# EAGLE design Proximity_sensor_sch (EAGLE 7.1.0)
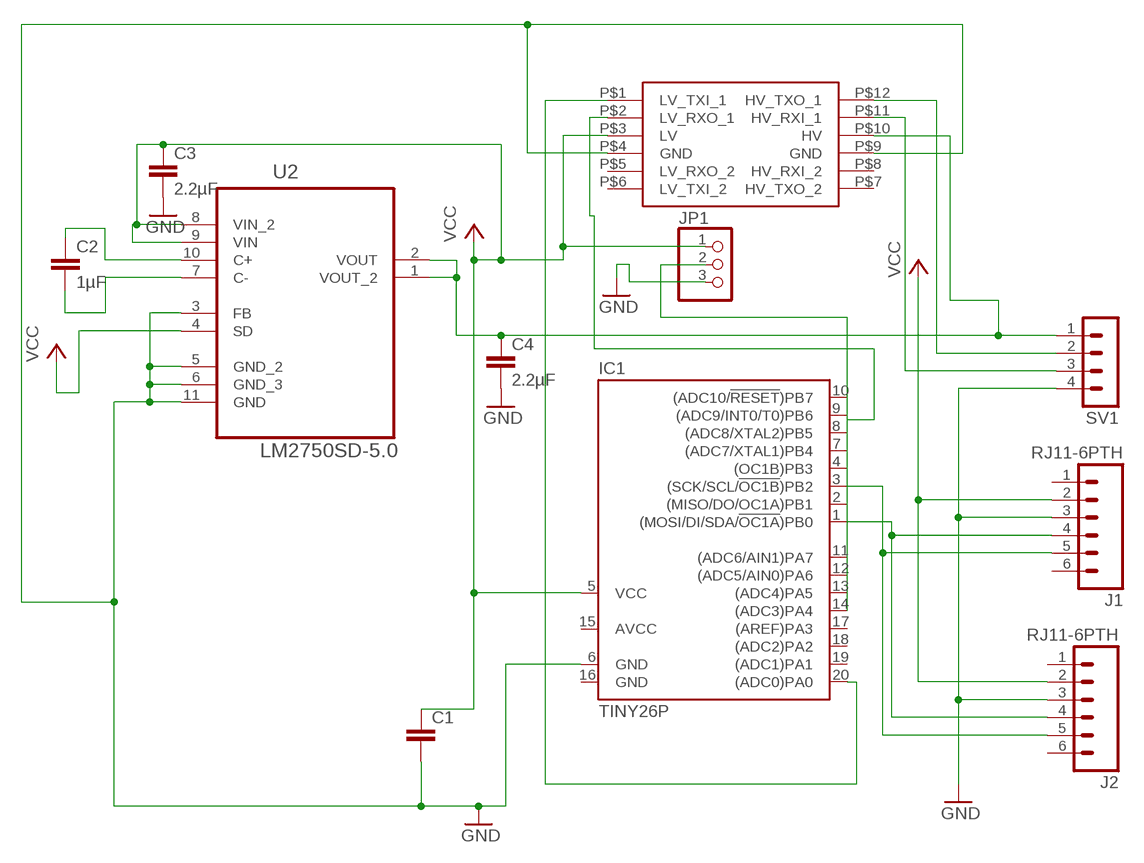
[diagram p0: schematic, sheet 1]

## Parts
C1  C7.5/3  [C7.5B3]
C2  1µF  C7.5/3  [C7.5B3]
C3  2.2µF  C7.5/3  [C7.5B3]
C4  2.2µF  C7.5/3  [C7.5B3]
IC1  TINY26P  [DIL20]
J1  RJ11-6PTH  [RJ11-6]
J2  RJ11-6PTH  [RJ11-6]
JP1  PINHD-1X3  [1X03]
SV1  MA04-1  [MA04-1]
U2  LM2750SD-5.0  [DFN300X300X80-11N]
U$1  LOGIC_LEVEL_CONVERTER  [LOGIC_LEVEL_CONVERTER]

## Nets
GND: C1.2 C3.2 C4.2 IC1.6(GND) J1.3 J2.3 JP1.3 SV1.4 U2.3(FB) U2.5(GND_2) U2.6(GND_3) U2.11(GND) U$1.P$4(GND) U$1.P$9(GND)
N$1: C4.1 SV1.1 U2.1(VOUT_2) U2.2(VOUT) U$1.P$10(HV)
N$2: IC1.1((MOSI/DI/SDA/!OC1A!)PB0) J1.4 J2.4
N$3: IC1.3((SCK/SCL/!OC1B!)PB2) J1.5 J2.5
N$4: IC1.20((ADC0)PA0) U$1.P$1(LV_TXI_1)
N$5: SV1.2 U$1.P$12(HV_TXO_1)
N$6: SV1.3 U$1.P$11(HV_RXI_1)
N$7: IC1.9((ADC9/INT0/T0)PB6) U$1.P$2(LV_RXO_1)
N$8: C2.1 U2.10(C+)
N$9: C2.2 U2.7(C-)
N$25: IC1.14((ADC3)PA4) JP1.2
VCC: C1.1 C3.1 IC1.5(VCC) J1.2 J2.2 JP1.1 U2.4(SD) U2.8(VIN_2) U2.9(VIN) U$1.P$3(LV)
Unconnected: IC1.2((MISO/DO/OC1A)PB1) IC1.4((OC1B)PB3) IC1.7((ADC7/XTAL1)PB4) IC1.8((ADC8/XTAL2)PB5) IC1.10((ADC10/!RESET!)PB7) IC1.11((ADC6/AIN1)PA7) IC1.12((ADC5/AIN0)PA6) IC1.13((ADC4)PA5) IC1.17((AREF)PA3) IC1.18((ADC2)PA2) IC1.19((ADC1)PA1) J1.1 J1.6 J2.1 J2.6 U$1.P$5(LV_RXO_2) U$1.P$6(LV_TXI_2) U$1.P$7(HV_TXO_2) U$1.P$8(HV_RXI_2)

## Power pins joined to a net without a drawn wire
AVCC: IC1.15(AVCC)
GND: IC1.16(GND)

## Library data of the parts
C1-C4 = capacitor-wima:C: CAPACITOR naming: grid - package width
IC1 = atmel:TINY26*: 8-bit AVR Microcontroller with 2K Bytes Flash Source: http://www.atmel.com .. doc1477.pdf; MPN: ATTINY261-20PU; OC_FARNELL: 1455146; OC_NEWARK: 58M3782
J1 J2 = SparkFun-Connectors:RJ11-6: RJ11 Jack Simple 6 pin RJ11 jack. Commonly found on CAT3 devices and Microchip programmers. SKU: PRT-00132
JP1 = adafruit:PINHD-1X3: PIN HEADER
SV1 = con-lstb:MA04-1: PIN HEADER; OC_FARNELL: unknown; OC_NEWARK: unknown
U2 = LM27050SD:LM2750SD-5.0: IC CONV REG SW CAP 5V; MPN: LM2750SD-5.0; OC_FARNELL: 1685760; OC_NEWARK: 69K2411; PACKAGE: 10-WFDFN Exposed Pad; SUPPLIER: National Semiconductor
U$1 = SparkFun-Boards:LOGIC_LEVEL_CONVERTER: Logic Level Converter (3.3v - 5v) https://www.sparkfun.com/products/8745

## Board
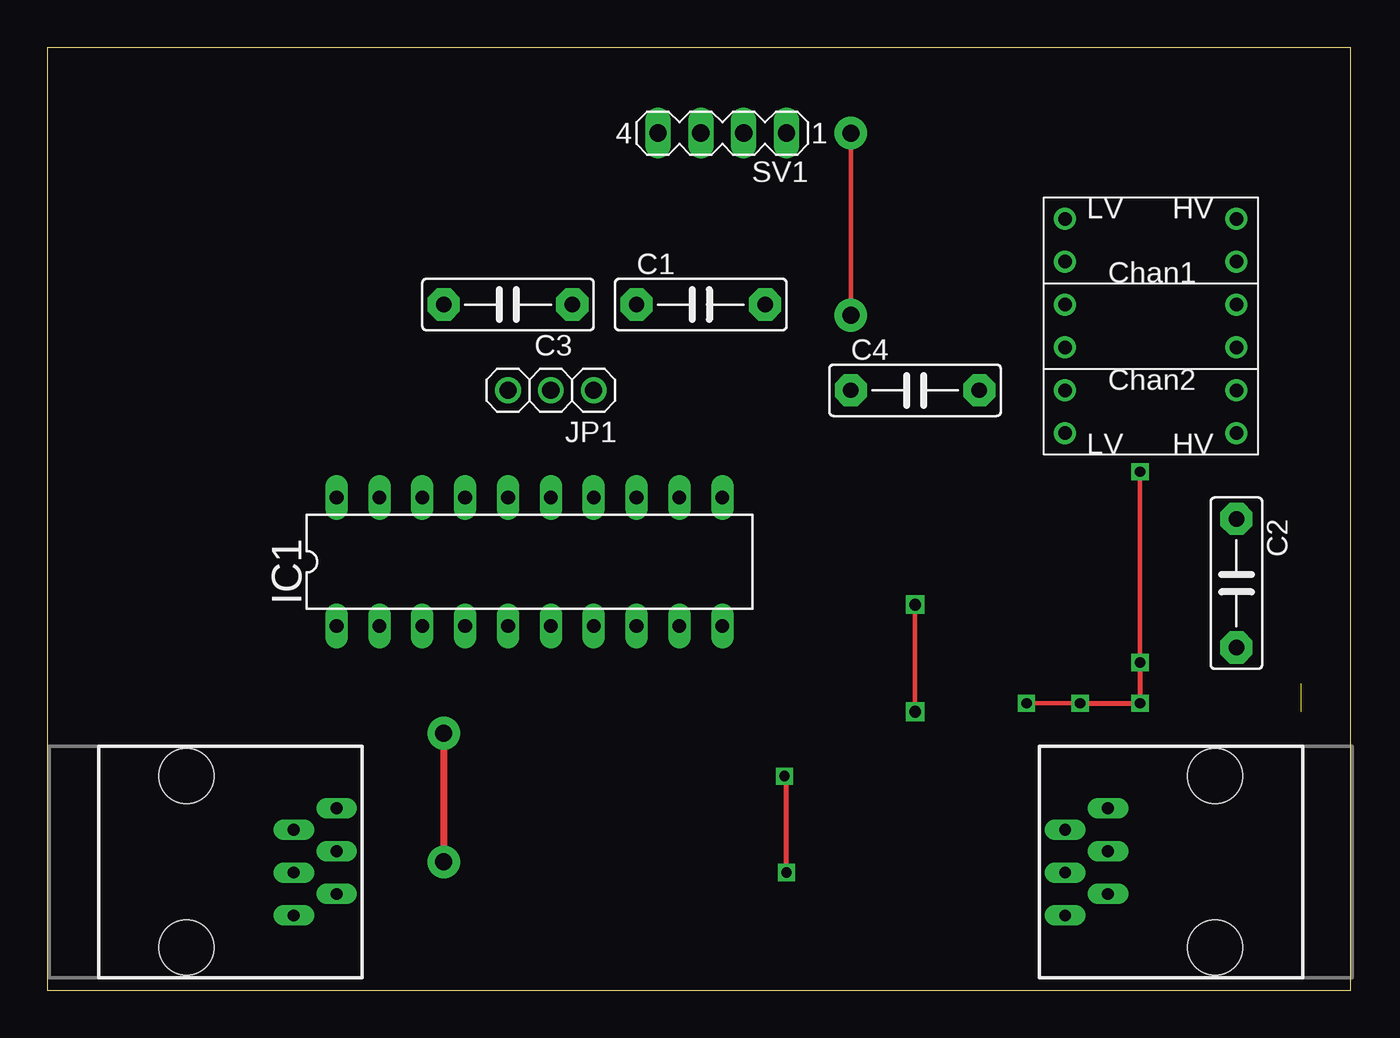
[diagram p1: board, top side]
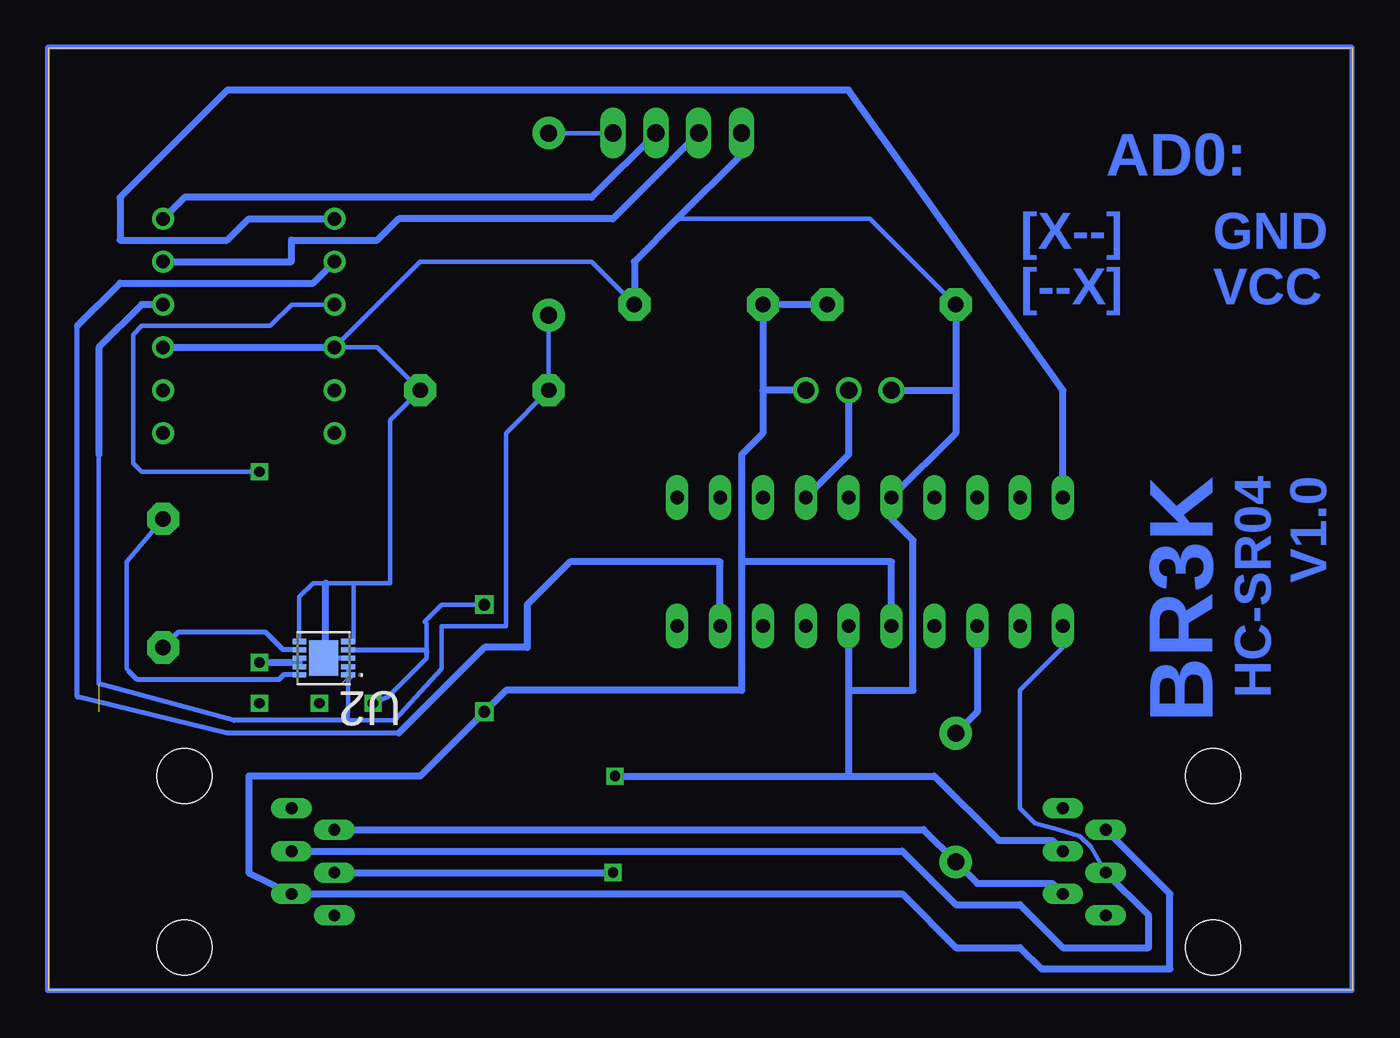
[diagram p2: board, bottom side, seen from below]

Size 77.27 x 55.87 mm. Coordinates in mm from the lower left corner, seen from the top.
Outline: 0,0 77.27,0 77.27,55.87 0,55.87 0,0
Copper layers (1*16): Top 0.035mm / dielectric 1.5mm / Bottom 0.035mm
Design rules "default *": minimum track width 10mil, minimum drill 24mil, track to track 8mil, track to pad 8mil, pad to pad 8mil, via to via 8mil, smd to smd 8mil, copper to edge 20mil, drill to drill 8mil, minimum pad ring 10mil, minimum via ring 8mil, stop-mask expansion 4mil, vias tented up to drill 0mil, thermal gap 10mil

### Footprints (pad centres in the part's own frame; a part is rotated, then mirrored left to right if it is on the bottom)
C7.5B3 = drill 0.914 pad 1.905 octagon: 1 -3.81,0; 2 3.81,0
DIL20 = drill 0.813 long: 1 -11.43,-3.81; 2 -8.89,-3.81; 3 -6.35,-3.81; 4 -3.81,-3.81; 5 -1.27,-3.81; 6 1.27,-3.81; 7 3.81,-3.81; 8 6.35,-3.81; 9 8.89,-3.81; 10 11.43,-3.81; 11 11.43,3.81; 12 8.89,3.81; 13 6.35,3.81; 14 3.81,3.81; 15 1.27,3.81; 16 -1.27,3.81; 17 -3.81,3.81; 18 -6.35,3.81; 19 -8.89,3.81; 20 -11.43,3.81
RJ11-6 = drill 0.7 long: 1 1.905,8.89; 2 3.175,6.35; 3 4.445,8.89; 4 5.715,6.35; 5 6.985,8.89; 6 8.255,6.35 | hole 3.251: 0,0; 10.16,0
1X03 = drill 1.016: 1 -2.54,0; 2 0,0; 3 2.54,0
MA04-1 = drill 1.016 long: 1 -3.81,0; 2 -1.27,0; 3 1.27,0; 4 3.81,0
DFN300X300X80-11N = smd 0.813 x 0.305: 1 -1.448,0.991; 2 -1.448,0.508; 3 -1.448,0; 4 -1.448,-0.508; 5 -1.448,-0.991; 6 1.448,-0.991; 7 1.448,-0.508; 8 1.448,0; 9 1.448,0.508; 10 1.448,0.991 | smd 1.702 x 2.108: 11 0,0
LOGIC_LEVEL_CONVERTER = drill 0.8: P$1 1.27,13.97; P$2 1.27,11.43; P$3 1.27,8.89; P$4 1.27,6.35; P$5 1.27,3.81; P$6 1.27,1.27; P$7 11.43,1.27; P$8 11.43,3.81; P$9 11.43,6.35; P$10 11.43,8.89; P$11 11.43,11.43; P$12 11.43,13.97

### Placement (x,y rotation side)
C1  38.73,40.64 0 top
C2  70.48,24.13 270 top
C3  27.31,40.64 180 top
C4  51.44,35.56 0 top
IC1  28.57,25.4 0 top
J1  69.22,2.54 90 top
J2  8.25,12.7 270 top
JP1  29.85,35.56 180 top
SV1  40,50.8 180 top
U2  60.96,19.68 180 bottom
U$1  59.06,31.75 0 top

### Tracks (layer width: path | path; a pad name or v marks a point on that pad's centre or on a via)
GND  (via drill 0.61)
  Top 0.305: v43.81,6.98 43.81,12.57 v43.69,12.7
  Bottom 0.254: C1.2 45.08,43.18 55.25,43.18 U$1.P$4 57.79,38.1 C4.2 57.02,33.78 57.02,24.13 59.18,24.13 | C3.2 28.57,45.72 40,45.72 | U2.6 62.41,23.32 61.59,24.13 60.83,24.13 59.18,24.13 | U2.5 59.18,20.68 59.18,24.13
  Bottom 0.305: U2.3 U2.11
  Bottom 0.406: J1.3 v43.81,6.98 | 43.81,12.7 v43.69,12.7 29.85,12.7 | 29.85,12.7 24.76,12.7 20.96,8.89 17.78,8.89 J2.3 | 29.85,17.78 29.85,12.7 | SV1.4 36.2,49.53 40,45.72 42.55,43.18 C1.2 | U$1.P$9 U$1.P$4 | C3.2 23.5,35.56 | 23.5,35.56 23.5,33.02 IC1.16 27.31,27.94 26.04,26.67 26.04,17.78 29.85,17.78 | JP1.3 23.5,35.56 | U2.11 60.83,19.68 60.83,24.13 | IC1.6 29.85,17.78
N$1  (via drill 1 pad 1.93)  (1 unrouted)
  Top 0.254: v47.62,50.8 v47.62,40
  Bottom 0.254: SV1.1 v47.62,50.8 | v47.62,40 C4.1 50.17,33.02 50.17,21.59 53.98,21.59 53.98,19.05 56.77,16 59.56,16 59.51,16.56 U2.1 | 59.36,18.54 U2.1 | U2.1 U2.2 | 74.3,31.75 74.3,18.16
  Bottom 0.305: 59.56,16 66.29,16 74.3,18.16
  Bottom 0.406: U$1.P$10 71.76,40.64 74.3,38.1 74.3,31.75
N$2
  Bottom 0.254: J2.4 15.49,8.51 16.13,9.14 17.4,9.53 18.8,9.91 19.68,10.8 19.68,17.78 17.14,20.32 IC1.1
  Bottom 0.406: J1.4 26.67,8.25 23.5,5.08 19.68,5.08 17.14,2.54 12.07,2.54 12.07,4.45 J2.4
N$3  (via drill 1 pad 1.93)
  Top 0.406: v23.5,15.24 v23.5,7.62
  Bottom 0.406: J1.5 25.4,9.53 v23.5,7.62 22.22,6.35 17.78,6.35 J2.5 | IC1.3 22.22,16.51 v23.5,15.24
N$4
  Bottom 0.406: IC1.20 17.14,35.56 29.85,53.34 66.67,53.34 73.03,46.99 73.03,44.45 66.67,44.45 65.41,45.72 U$1.P$1
N$5
  Bottom 0.406: SV1.2 45.08,46.99 69.22,46.99 U$1.P$12
N$6
  Bottom 0.406: SV1.3 43.81,45.72 56.52,45.72 57.79,44.45 62.87,44.45 62.87,43.18 U$1.P$11
N$7
  Bottom 0.305: 56.52,15.24 66.67,15.24 75.56,17.4 75.56,39.37
  Bottom 0.406: IC1.9 37.47,25.4 46.36,25.4 48.9,22.86 48.9,20.32 51.44,20.32 56.52,15.24 | 75.56,39.37 73.03,41.91 61.59,41.91 U$1.P$2
N$8
  Bottom 0.254: 72.29,18.69 72.52,18.92 72.64,19.05 72.64,25.4 C2.1
  Bottom 0.305: U2.10 63.35,18.69 63.63,18.41 72.01,18.41 72.52,18.92
N$9
  Bottom 0.254: C2.2 70.36,20.19
  Bottom 0.305: U2.7 63.37,20.19 64.39,21.21 69.6,21.21 C2.2
N$25
  Bottom 0.406: JP1.2 29.85,31.75 IC1.14
N$26
  Bottom 0.305: 0,55.88 77.34,55.88 77.34,0 0,0 0,55.88
VCC  (via drill 0.61, 0.61 pad 0.61, 0.7 pad 1.02)
  Top 0.254: v51.44,16.51 v51.44,22.86 | v61.21,17.02 v58.04,17.02 | v64.77,30.73 v64.77,19.43
  Top 0.305: v64.77,19.43 v64.77,17.02 v61.21,17.02
  Bottom 0.254: U$1.P$3 62.87,40.64 64.14,39.37 71.76,39.37 72.26,38.86 72.26,31.24 71.76,30.73 v64.77,30.73 | v51.44,22.86 53.98,22.86 54.99,21.84 54.86,21.72 54.86,19.94 54.86,19.68 57.15,17.4 v58.04,17.02 | U2.8 62.41,19.43 U2.9
  Bottom 0.305: U2.4 54.86,20.19 54.86,19.94
  Bottom 0.406: J1.2 26.67,5.71 23.5,2.54 19.68,2.54 18.42,1.27 10.8,1.27 10.8,5.71 J2.2 | J1.2 49.53,5.71 | 36.2,25.4 36.2,17.78 50.17,17.78 v51.44,16.51 55.25,12.7 65.41,12.7 65.41,6.98 J1.2 | 34.92,35.56 C1.1 C3.1 | 34.92,35.56 34.92,33.02 36.2,31.75 36.2,25.4 | JP1.1 34.92,35.56 | v64.77,19.43 62.41,19.43 | IC1.5 27.31,25.4 36.2,25.4
(copper drawn outside any net)
  shapes: Bottom circle x4

### Text on the board
Bottom: AD0: | GND / VCC | [X--] / [--X] | HC-SR04 / V1.0 | BR3K